# EAGLE design dumbpad (EAGLE 9.6.1)
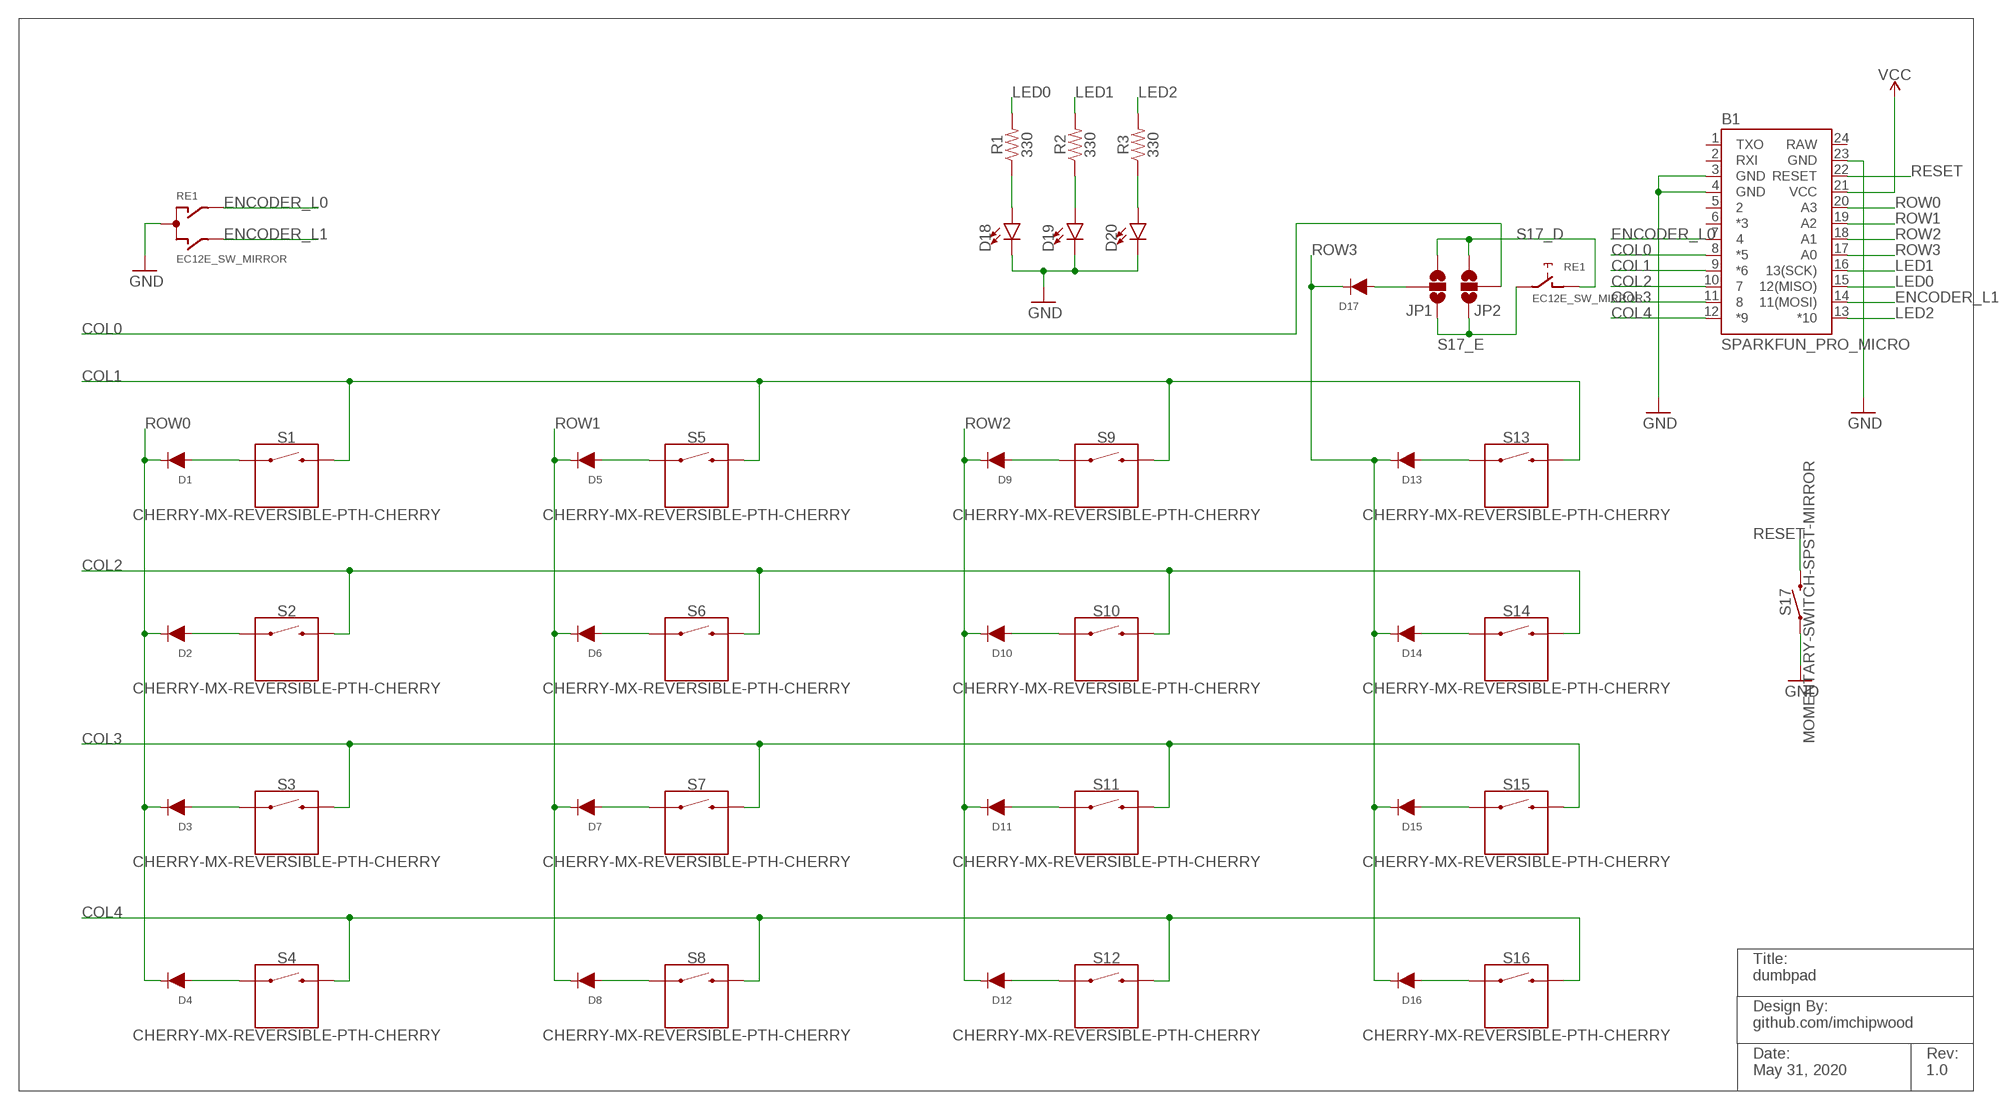
[diagram p0: schematic, sheet 1]

## Parts
B1  SPARKFUN_PRO_MICRO  [SPARKFUN_PRO_MICRO]
D1  DO-1N4148_MIRROR  [DO-1N4148_MIRROR]
D2  DO-1N4148_MIRROR  [DO-1N4148_MIRROR]
D3  DO-1N4148_MIRROR  [DO-1N4148_MIRROR]
D4  DO-1N4148_MIRROR  [DO-1N4148_MIRROR]
D5  DO-1N4148_MIRROR  [DO-1N4148_MIRROR]
D6  DO-1N4148_MIRROR  [DO-1N4148_MIRROR]
D7  DO-1N4148_MIRROR  [DO-1N4148_MIRROR]
D8  DO-1N4148_MIRROR  [DO-1N4148_MIRROR]
D9  DO-1N4148_MIRROR  [DO-1N4148_MIRROR]
D10  DO-1N4148_MIRROR  [DO-1N4148_MIRROR]
D11  DO-1N4148_MIRROR  [DO-1N4148_MIRROR]
D12  DO-1N4148_MIRROR  [DO-1N4148_MIRROR]
D13  DO-1N4148_MIRROR  [DO-1N4148_MIRROR]
D14  DO-1N4148_MIRROR  [DO-1N4148_MIRROR]
D15  DO-1N4148_MIRROR  [DO-1N4148_MIRROR]
D16  DO-1N4148_MIRROR  [DO-1N4148_MIRROR]
D17  DO-1N4148_MIRROR  [DO-1N4148_MIRROR]
D18  LED3MM  [LED_3MM]
D19  LED3MM  [LED_3MM]
D20  LED3MM  [LED_3MM]
JP1  JUMPER-SMT_3_NO_NO_SILK  [SMT-JUMPER_3_0-NO_TRACE_NO-SILK]
JP2  JUMPER-SMT_3_NO_NO_SILK  [SMT-JUMPER_3_0-NO_TRACE_NO-SILK]
R1  330  RESISTOR_MIRROR  [AXIAL-0.3_MIRROR]
R2  330  RESISTOR_MIRROR  [AXIAL-0.3_MIRROR]
R3  330  RESISTOR_MIRROR  [AXIAL-0.3_MIRROR]
RE1  EC12E_SW_MIRROR  [ALPS_EC12E_SW_MIRROR]
S1  CHERRY-MX-REVERSIBLE-PTH-CHERRY  [CHERRY-MX-REVERSIBLE]
S2  CHERRY-MX-REVERSIBLE-PTH-CHERRY  [CHERRY-MX-REVERSIBLE]
S3  CHERRY-MX-REVERSIBLE-PTH-CHERRY  [CHERRY-MX-REVERSIBLE]
S4  CHERRY-MX-REVERSIBLE-PTH-CHERRY  [CHERRY-MX-REVERSIBLE]
S5  CHERRY-MX-REVERSIBLE-PTH-CHERRY  [CHERRY-MX-REVERSIBLE]
S6  CHERRY-MX-REVERSIBLE-PTH-CHERRY  [CHERRY-MX-REVERSIBLE]
S7  CHERRY-MX-REVERSIBLE-PTH-CHERRY  [CHERRY-MX-REVERSIBLE]
S8  CHERRY-MX-REVERSIBLE-PTH-CHERRY  [CHERRY-MX-REVERSIBLE]
S9  CHERRY-MX-REVERSIBLE-PTH-CHERRY  [CHERRY-MX-REVERSIBLE]
S10  CHERRY-MX-REVERSIBLE-PTH-CHERRY  [CHERRY-MX-REVERSIBLE]
S11  CHERRY-MX-REVERSIBLE-PTH-CHERRY  [CHERRY-MX-REVERSIBLE]
S12  CHERRY-MX-REVERSIBLE-PTH-CHERRY  [CHERRY-MX-REVERSIBLE]
S13  CHERRY-MX-REVERSIBLE-PTH-CHERRY  [CHERRY-MX-REVERSIBLE]
S14  CHERRY-MX-REVERSIBLE-PTH-CHERRY  [CHERRY-MX-REVERSIBLE]
S15  CHERRY-MX-REVERSIBLE-PTH-CHERRY  [CHERRY-MX-REVERSIBLE]
S16  CHERRY-MX-REVERSIBLE-PTH-CHERRY  [CHERRY-MX-REVERSIBLE]
S17  MOMENTARY-SWITCH-SPST-MIRROR  [TACTILE_SWITCH_PTH_6.0MM_MIRROR]

## Nets
COL0: B1.8(*5) JP2.2
COL1: B1.9(*6) S1.S2_0 S1.S2_1 S5.S2_0 S5.S2_1 S9.S2_0 S9.S2_1 S13.S2_0 S13.S2_1
COL2: B1.10 S2.S2_0 S2.S2_1 S6.S2_0 S6.S2_1 S10.S2_0 S10.S2_1 S14.S2_0 S14.S2_1
COL3: B1.11 S3.S2_0 S3.S2_1 S7.S2_0 S7.S2_1 S11.S2_0 S11.S2_1 S15.S2_0 S15.S2_1
COL4: B1.12(*9) S4.S2_0 S4.S2_1 S8.S2_0 S8.S2_1 S12.S2_0 S12.S2_1 S16.S2_0 S16.S2_1
ENCODER_L0: B1.7 RE1.A
ENCODER_L1: B1.14(11(MOSI)) RE1.B
GND: B1.3(GND) B1.4(GND) B1.23(GND) D18.K(C) D19.K(C) D20.K(C) RE1.C S17.1
LED0: B1.15(12(MISO)) R1.P$2
LED1: B1.16(13(SCK)) R2.P$2
LED2: B1.13(*10) R3.P$2
N$1: D4.A S4.S1_0 S4.S1_1
N$2: D3.A S3.S1_0 S3.S1_1
N$3: D2.A S2.S1_0 S2.S1_1
N$4: D1.A S1.S1_0 S1.S1_1
N$5: D18.A R1.P$1
N$6: D8.A S8.S1_0 S8.S1_1
N$7: D7.A S7.S1_0 S7.S1_1
N$8: D6.A S6.S1_0 S6.S1_1
N$9: D5.A S5.S1_0 S5.S1_1
N$10: D20.A R3.P$1
N$11: D16.A S16.S1_0 S16.S1_1
N$12: D15.A S15.S1_0 S15.S1_1
N$13: D14.A S14.S1_0 S14.S1_1
N$14: D13.A S13.S1_0 S13.S1_1
N$15: D19.A R2.P$1
N$16: D12.A S12.S1_0 S12.S1_1
N$17: D11.A S11.S1_0 S11.S1_1
N$18: D10.A S10.S1_0 S10.S1_1
N$19: D9.A S9.S1_0 S9.S1_1
RESET: B1.22(RESET) S17.2
ROW0: B1.20(A3) D1.C D2.C D3.C D4.C
ROW1: B1.19(A2) D5.C D6.C D7.C D8.C
ROW2: B1.18(A1) D9.C D10.C D11.C D12.C
ROW3: B1.17(A0) D13.C D14.C D15.C D16.C D17.C
ROW3_A: D17.A JP1.2
S17_D: JP1.1 JP2.3 RE1.D
S17_E: JP1.3 JP2.1 RE1.E
VCC: B1.21(VCC)
Unconnected: B1.1(TXO) B1.2(RXI) B1.5 B1.6(*3) RE1.GND1(G) RE1.GND2(G)

## Notes on the sheet
- Title:
  dumbpad
- Design By:
  github.com/imchipwood
- Date:
  May 31, 2020
- Rev:
  1.0

## Power pins joined to a net without a drawn wire
RAW: B1.24(RAW)

## Library data of the parts
B1 = SparkFun-Boards:SPARKFUN_PRO_MICRO: SparkFun Pro Micro Atmega32U4 compatible footprint. SparkFun Products: 3.3V/8MHz <https://www.sparkfun.com/products/12587> 5V/16MHz <https://www.sparkfun.com/products/12640>
D1-D17 = cpwood:DO-1N4148_MIRROR: 1N4148 Diode - Thru-hole
D18-D20 = SparkFun-LED:LED: LED (Generic) Standard schematic elements and footprints for 5mm, 3mm, 1206, and 0603 sized LEDs. Generic LEDs with no color specified.; PROD_ID: DIO-08794
JP1 JP2 = cpwood:JUMPER-SMT_3_NO: Normally open jumper This jumper has three pads in close proximity to each other. Apply solder to close the connection(s).
R1-R3 = cpwood:RESISTOR_MIRROR: RESISTOR THRU-HOLE MIRROR 0.3IN
RE1 = cpwood:EC12E_SW_MIRROR: ALPS rotary Encoder EC12E series with switch; MPN: EC12E2424407; OC_FARNELL: 1520813; OC_NEWARK: 74M1068
S1-S16 = cpwood:CHERRY-MX-REVERSIBLE: Momentary Switch (Pushbutton) - SPST; SF_ID: COM-13834
S17 = cpwood:MOMENTARY-SWITCH-SPST-MIRROR

## Board
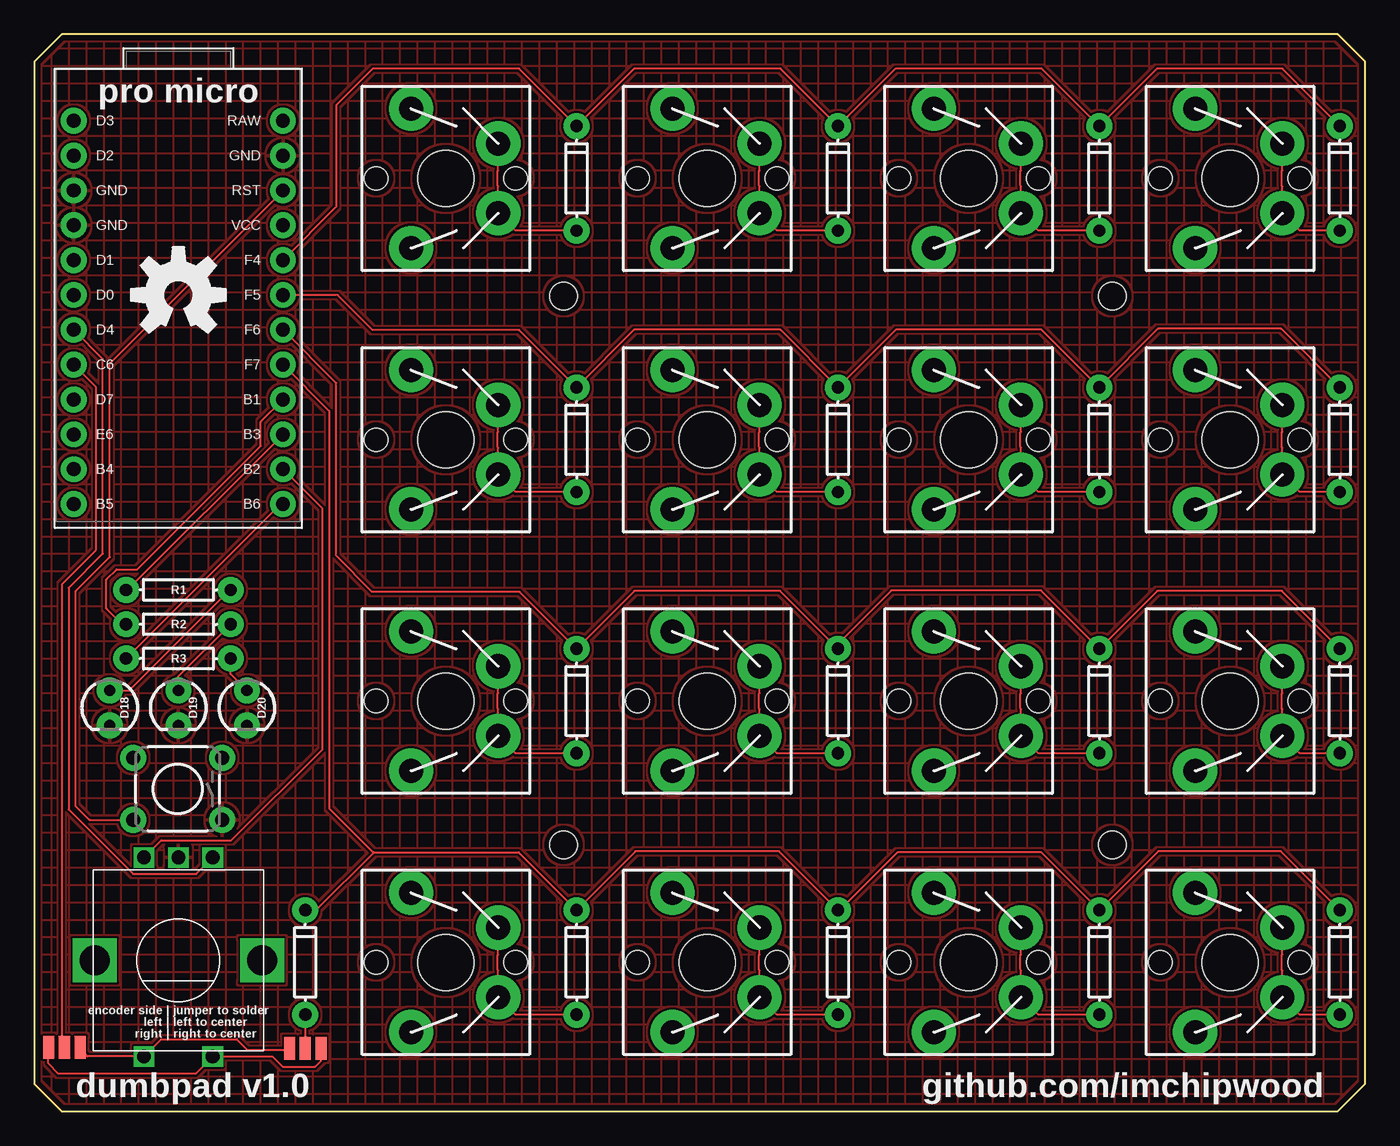
[diagram p1: board, top side]
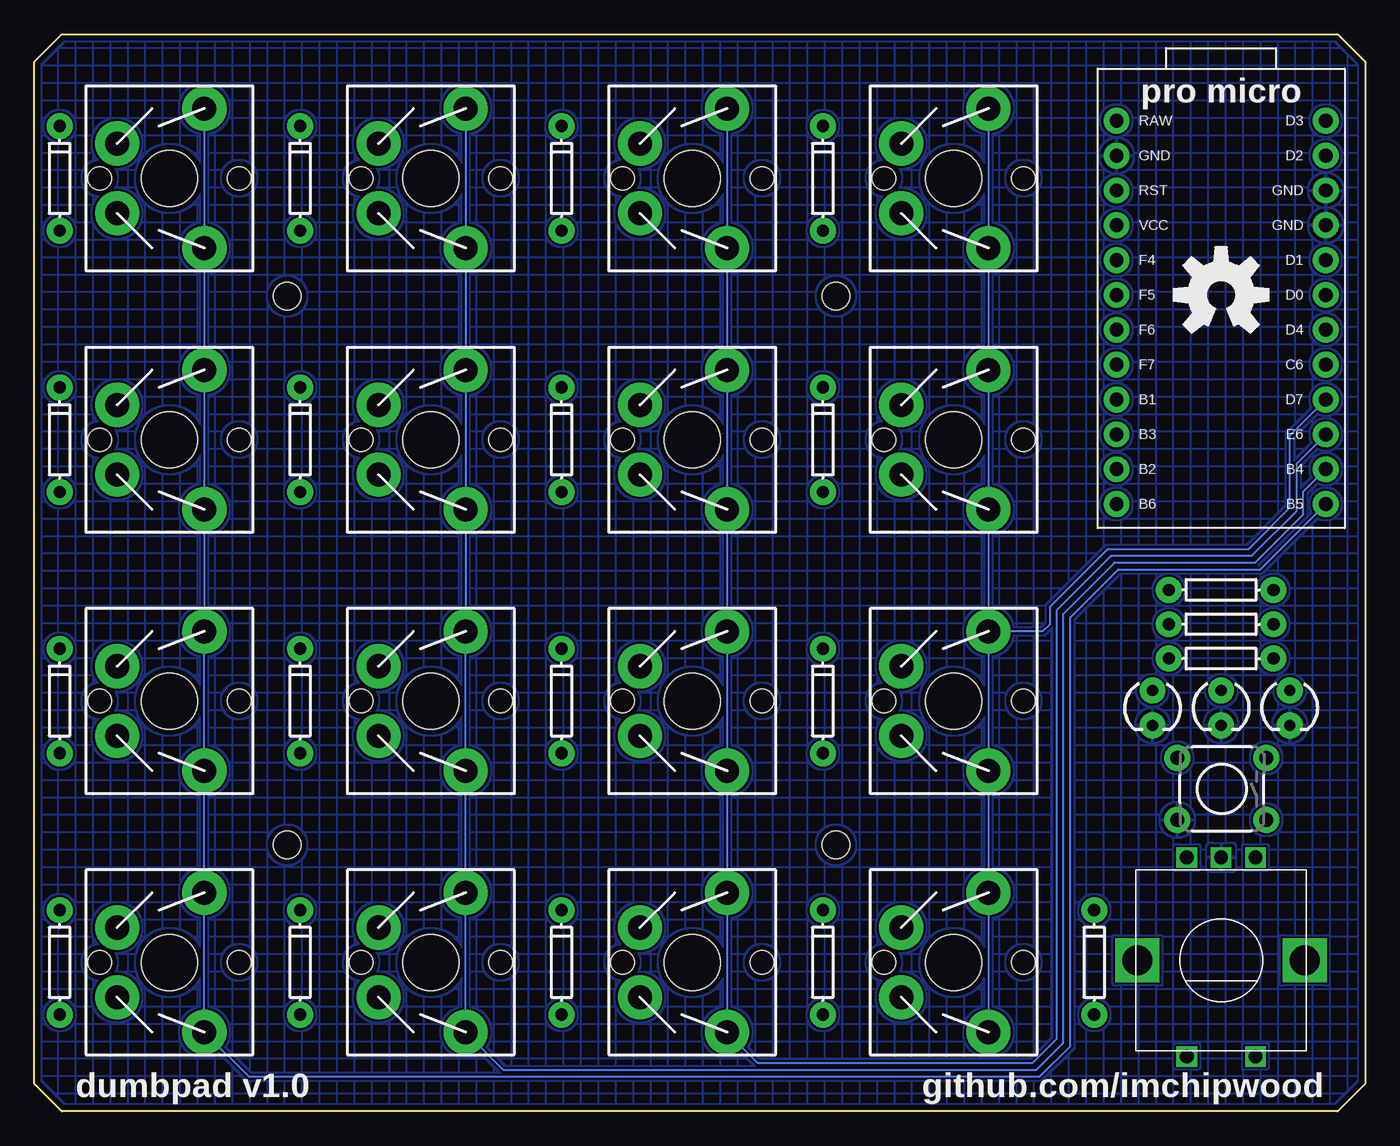
[diagram p2: board, bottom side, seen from below]

Size 97 x 78.5 mm. Coordinates in mm from the lower left corner, seen from the top.
Outline: 0,2 2,0 95,0 97,2 97,76.5 95,78.5 2,78.5 0,76.5 0,2
Copper layers (1*16): Top 0.035559375mm / dielectric 1.6mm / Bottom 0.035559375mm
Design rules "oshpark_2layer": minimum track width 6mil, minimum drill 10mil, track to track 6mil, track to pad 6mil, pad to pad 6mil, via to via 6mil, smd to smd 6mil, copper to edge 15mil, drill to drill 6mil, minimum pad ring 5mil, minimum via ring 5mil, stop-mask expansion 2.5mil, vias tented up to drill 0mil, thermal gap 10mil
Holes 2 mm at 38.58,59.42 78.58,59.42 38.58,19.43 78.58,19.43

### Footprints (pad centres in the part's own frame; a part is rotated, then mirrored left to right if it is on the bottom)
SPARKFUN_PRO_MICRO = drill 1.016 pad 1.88: 1 -7.62,12.7; 2 -7.62,10.16; 3 -7.62,7.62; 4 -7.62,5.08; 5 -7.62,2.54; 6 -7.62,0; 7 -7.62,-2.54; 8 -7.62,-5.08; 9 -7.62,-7.62; 10 -7.62,-10.16; 11 -7.62,-12.7; 12 -7.62,-15.24; 13 7.62,-15.24; 14 7.62,-12.7; 15 7.62,-10.16; 16 7.62,-7.62; 17 7.62,-5.08; 18 7.62,-2.54; 19 7.62,0; 20 7.62,2.54; 21 7.62,5.08; 22 7.62,7.62; 23 7.62,10.16; 24 7.62,12.7
DO-1N4148_MIRROR = drill 0.9 pad 1.88: A -3.81,0; C 3.81,0
LED_3MM = drill 0.813 pad 1.88: A -1.27,0; K 1.27,0
SMT-JUMPER_3_0-NO_TRACE_NO-SILK = smd 0.813 x 1.676: 1 -1.143,0; 2 0,0; 3 1.143,0
AXIAL-0.3_MIRROR = drill 0.9 pad 1.88: P$1 -3.81,0; P$2 3.81,0
ALPS_EC12E_SW_MIRROR = drill 1 square: A -2.5,-7.5; B 2.5,-7.5; C 0,-7.5; D -2.5,7; E 2.5,7 | drill 2.2 square: GND1 -6.1,0; GND2 6.1,0
CHERRY-MX-REVERSIBLE = drill 1.753 pad 3.226: S1_0 -3.81,-2.54; S1_1 -3.81,2.54; S2_0 2.54,-5.08; S2_1 2.54,5.08 | hole 4.089: 0,0 | hole 1.707: 5.08,0; -5.08,0
TACTILE_SWITCH_PTH_6.0MM_MIRROR = drill 1.016 pad 1.88: 1 -3.251,2.261; 2 3.251,2.261; 3 -3.251,-2.261; 4 3.251,-2.261

### Placement (x,y rotation side)
B1  10.5,59.5 0 top
D1  39.52,68 90 top
D2  58.58,68 90 top
D3  77.62,68 90 top
D4  95.15,68 90 top
D5  39.52,48.95 90 top
D6  58.58,48.95 90 top
D7  77.62,48.95 90 top
D8  95.15,48.95 90 top
D9  39.52,29.9 90 top
D10  58.58,29.9 90 top
D11  77.62,29.9 90 top
D12  95.15,29.9 90 top
D13  39.52,10.85 90 top
D14  58.58,10.85 90 top
D15  77.62,10.85 90 top
D16  95.15,10.85 90 top
D17  19.75,10.85 90 top
D18  5.5,29.4 270 top
D19  10.5,29.4 270 top
D20  15.5,29.4 270 top
JP1  19.75,4.6 180 top
JP2  2.2,4.65 180 top
LOGO1  OSHW-LOGOL  [OSHW-LOGO-L]  10.5,59.5 0 bottom
LOGO2  OSHW-LOGOL  [OSHW-LOGO-L]  10.5,59.5 0 bottom
LOGO3  OSHW-LOGOL  [OSHW-LOGO-L]  10.5,59.5 0 top
R1  10.5,38 180 top
R2  10.5,35.5 180 top
R3  10.5,33 180 top
RE1  10.5,11 180 top
S1  30,68 180 top
S2  49.05,68 180 top
S3  68.1,68 180 top
S4  87.15,68 180 top
S5  30,48.95 180 top
S6  49.05,48.95 180 top
S7  68.1,48.95 180 top
S8  87.15,48.95 180 top
S9  30,29.9 180 top
S10  49.05,29.9 180 top
S11  68.1,29.9 180 top
S12  87.15,29.9 180 top
S13  30,10.85 180 top
S14  49.05,10.85 180 top
S15  68.1,10.85 180 top
S16  87.15,10.85 180 top
S17  10.45,23.5 180 top

### Tracks (layer width: path | path; a pad name or v marks a point on that pad's centre or on a via)
COL0
  Top 0.152: B1.8 4.5,52.8 4.5,40.9 2,38.4 2,4.85 JP2.2
COL1
  Bottom 0.152: S1.S2_0 S1.S2_1 S5.S2_0 S5.S2_1 S9.S2_0 | S9.S2_0 S9.S2_1 S13.S2_0 S13.S2_1 | 27.02,34.98 S9.S2_0 | S9.S2_0 23.52,34.98 23,35.5 23,36.75 18.75,41 8.5,41 5.5,44 5.5,49.26 B1.9
COL2
  Bottom 0.152: S2.S2_0 S2.S2_1 S6.S2_0 S6.S2_1 S10.S2_0 S10.S2_1 S14.S2_0 S14.S2_1 44.24,3.5 24.25,3.5 22.5,5.25 22.5,36.5 18.5,40.5 8.25,40.5 5,43.75 5,47.22 B1.10
COL3
  Bottom 0.152: S3.S2_0 S3.S2_1 S7.S2_0 S7.S2_1 S11.S2_0 S11.S2_1 S15.S2_0 S15.S2_1 62.79,3 24,3 22,5 22,36.25 18.25,40 8,40 4.5,43.5 4.5,45.18 B1.11
COL4
  Bottom 0.152: B1.12 7.64,39.5 18,39.5 21.5,36 21.5,4.75 23.75,2.5 81.34,2.5 S16.S2_1 S16.S2_0 S12.S2_1 S12.S2_0 S8.S2_1 S8.S2_0 S4.S2_1 S4.S2_0
ENCODER_L0
  Top 0.152: B1.7 5,54.84 5,40.65 2.5,38.15 2.5,22 7.2,17.3 11.8,17.3 RE1.A
ENCODER_L1
  Top 0.152: RE1.B 9.25,19.75 14.36,19.75 21,26.39 21,43.92 B1.14
GND
  pour Top (hatched): 0,2 2,0 95,0 97,2 97,76.5 95,78.5 2,78.5 0,76.5
  pour Bottom (hatched): 0,2 2,0 95,0 97,2 97,76.5 95,78.5 2,78.5 0,76.5
LED0
  Top 0.152: R1.P$2 6.78,38 B1.15
LED1
  Top 0.152: R2.P$2 6.4,35.5 5.25,36.65 5.25,38.75 6,39.5 7.5,39.5 16.5,48.5 16.5,50.26 B1.16
LED2
  Top 0.152: R3.P$2 17.95,44.26 B1.13
N$1
  Top 0.152: D4.A 92.23,64.19 S4.S1_1 90.96,67.42 90.92,67.46 90.92,68.54 90.96,68.58 S4.S1_0
N$2
  Top 0.152: D3.A 73.18,64.19 S3.S1_1 71.91,67.42 71.87,67.46 71.87,68.54 71.91,68.58 S3.S1_0
N$3
  Top 0.152: D2.A 54.13,64.19 S2.S1_1 52.86,67.42 52.82,67.46 52.82,68.54 52.86,68.58 S2.S1_0
N$4
  Top 0.152: D1.A 35.08,64.19 S1.S1_1 33.81,67.42 33.77,67.46 33.77,68.54 33.81,68.58 S1.S1_0
N$5
  Top 0.152: R1.P$1 14.25,38 6.92,30.67 D18.A
N$6
  Top 0.152: D8.A 92.23,45.14 S8.S1_1 90.96,48.37 90.92,48.41 90.92,49.49 90.96,49.53 S8.S1_0
N$7
  Top 0.152: D7.A 73.18,45.14 S7.S1_1 71.91,48.37 71.87,48.41 71.87,49.49 71.91,49.53 S7.S1_0
N$8
  Top 0.152: D6.A 54.13,45.14 S6.S1_1 52.86,48.37 52.82,48.41 52.82,49.49 52.86,49.53 S6.S1_0
N$9
  Top 0.152: D5.A 35.08,45.14 S5.S1_1 33.81,48.37 33.77,48.41 33.77,49.49 33.81,49.53 S5.S1_0
N$10
  Top 0.152: D20.A 14.31,31.86 R3.P$1
N$11
  Top 0.152: D16.A 92.23,7.04 S16.S1_1 90.96,10.27 90.92,10.31 90.92,11.39 90.96,11.43 S16.S1_0
N$12
  Top 0.152: D15.A 73.18,7.04 S15.S1_1 71.91,10.27 71.87,10.31 71.87,11.39 71.91,11.43 S15.S1_0
N$13
  Top 0.152: D14.A 54.13,7.04 S14.S1_1 52.86,10.27 52.82,10.31 52.82,11.39 52.86,11.43 S14.S1_0
N$14
  Top 0.152: D13.A 35.08,7.04 S13.S1_1 33.81,10.27 33.77,10.31 33.77,11.39 33.81,11.43 S13.S1_0
N$15
  Top 0.152: D19.A 10.5,31.69 R2.P$1
N$16
  Top 0.152: D12.A 92.23,26.09 S12.S1_1 90.96,29.32 90.92,29.36 90.92,30.44 90.96,30.48 S12.S1_0
N$17
  Top 0.152: D11.A 73.18,26.09 S11.S1_1 71.91,29.32 71.87,29.36 71.87,30.44 71.91,30.48 S11.S1_0
N$18
  Top 0.152: D10.A 54.13,26.09 S10.S1_1 52.86,29.32 52.82,29.36 52.82,30.44 52.86,30.48 S10.S1_0
N$19
  Top 0.152: D9.A 35.08,26.09 S9.S1_1 33.81,29.32 33.77,29.36 33.77,30.44 33.81,30.48 S9.S1_0
RESET
  Top 0.152: B1.22 5.5,54.5 5.5,40.4 3,37.9 3,22.25 4.01,21.24 S17.2
ROW0
  Top 0.152: D4.C 90.96,76 81.81,76 D3.C 73.44,76 62.77,76 D2.C 54.38,76 43.72,76 D1.C 35.34,76 24.66,76 22,73.34 22,65.92 B1.20
ROW1
  Top 0.152: D8.C 90.87,57.04 81.9,57.04 D7.C 73.4,56.99 62.8,56.99 D6.C 54.37,56.96 43.73,56.96 D5.C 35.34,56.95 24.67,56.95 22.12,59.5 B1.19
ROW2
  Top 0.152: B1.18 22,53.08 22,40.5 24.64,37.86 35.37,37.86 D9.C 43.74,37.92 54.36,37.92 58.39,33.89 | D10.C 58.39,33.89 | 58.39,33.89 62.46,37.96 73.37,37.96 D11.C 81.84,37.92 90.94,37.92 D12.C
ROW3
  Top 0.152: B1.17 21.5,51.04 21.5,22.07 24.68,18.89 24.75,18.89 | D16.C 90.86,18.95 81.92,18.95 D15.C 73.4,18.89 62.91,18.89 58.69,14.66 D14.C 54.28,18.95 43.81,18.95 D13.C 35.3,18.89 24.75,18.89 | 19.75,14.71 D17.C 20.52,14.66 24.75,18.89
ROW3_A
  Top 0.152: D17.A JP1.2
S17_D
  Top 0.152: JP1.1 20.89,3.69 20.45,3.25 18.1,3.25 17.35,4 RE1.D 11.75,2.75 1.75,2.75 1,3.5 1,4.59 JP2.3
S17_E
  Top 0.152: JP2.1 3.87,4 RE1.E 9.25,5.25 14.75,5.25 15.5,4.5 18.51,4.5 JP1.3

### Text on the board
tPlace: dumbpad v1.0 | github.com/imchipwood
bPlace: github.com/imchipwood | dumbpad v1.0
tNames: pro micro | D3 | RAW | D2 | GND | GND | RST | GND | VCC | D1 | F4 | D0 | F5 | D4 | F6 | C6 | F7 | D7 | B1 | E6 | B3 | B4 | B2 | B5 | B6 | encoder side | jumper to solder | left | left to center | right | right to center
bNames: pro micro | D3 | RAW | D2 | GND | GND | RST | GND | VCC | D1 | F4 | D0 | F5 | D4 | F6 | C6 | F7 | D7 | B1 | E6 | B3 | B4 | B2 | B5 | B6